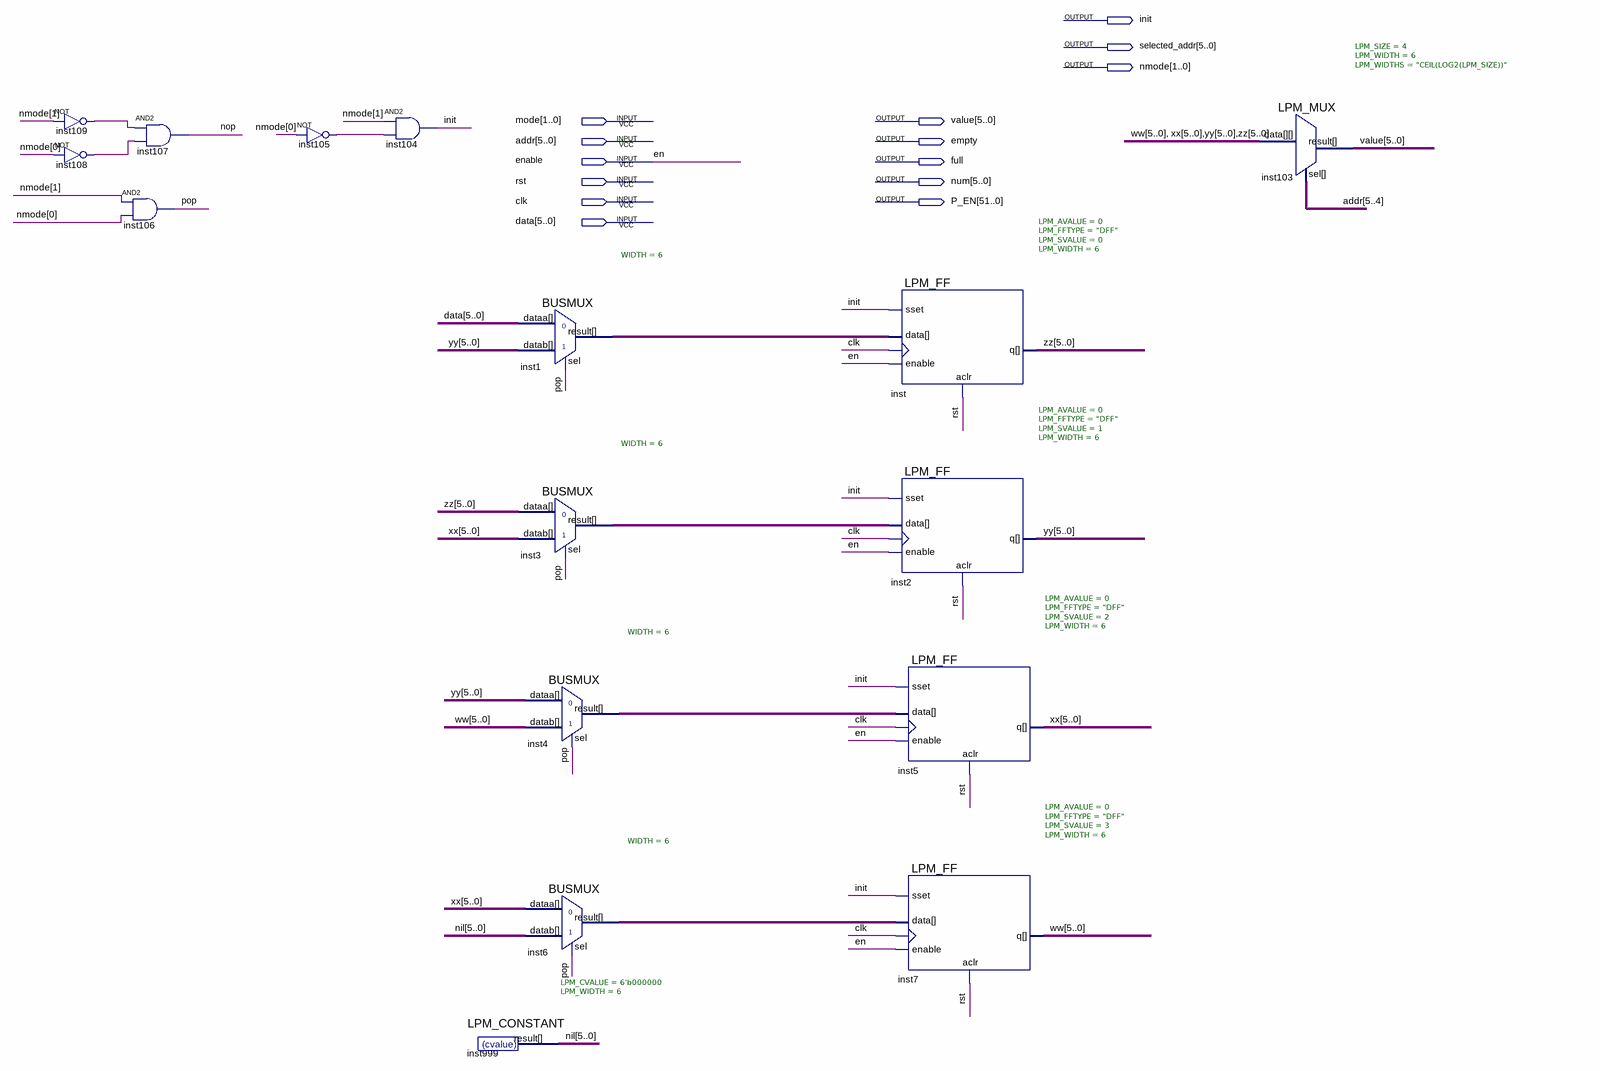
[diagram p0: schematic sheet]
// Quartus schematic g58_stack.bdf as structural Verilog: 16 symbols, 14 pins
module g58_stack (
  input  [1:0] mode,
  input  [5:0] addr,
  input  enable,
  input  rst,
  input  clk,
  input  [5:0] data,
  output init,
  output [5:0] selected_addr,
  output [1:0] nmode,
  output [5:0] value,
  output empty,
  output full,
  output [5:0] num,
  output [51:0] P_EN
);

  wire inst105_out, inst108_out, inst109_out, nop, pop;
  wire [5:0] inst1_result, inst3_result, inst4_result, inst6_result, nil, ww, xx, yy, zz;

  not inst109 (inst109_out, nmode[1]);
  not inst108 (inst108_out, nmode[0]);
  and inst107 (nop, inst109_out, inst108_out);
  and inst106 (pop, nmode[1], nmode[0]);
  not inst105 (inst105_out, nmode[0]);
  and inst104 (init, nmode[1], inst105_out);
  LPM_CONSTANT #(.LPM_CVALUE(6'b000000), .LPM_WIDTH(6)) inst999 (.result(nil));
  BUSMUX #(.WIDTH(6)) inst1 (.datab(yy), .sel(pop), .dataa(data), .result(inst1_result));
  BUSMUX #(.WIDTH(6)) inst3 (.datab(xx), .sel(pop), .dataa(zz), .result(inst3_result));
  BUSMUX #(.WIDTH(6)) inst4 (.datab(ww), .sel(pop), .dataa(yy), .result(inst4_result));
  BUSMUX #(.WIDTH(6)) inst6 (.datab(nil), .sel(pop), .dataa(xx), .result(inst6_result));
  LPM_FF #(.LPM_AVALUE(0), .LPM_FFTYPE("DFF"), .LPM_SVALUE(0), .LPM_WIDTH(6)) inst (
    .aclr(rst), .clock(clk), .data(inst1_result), .enable(enable), .sset(init), .q(zz));
  LPM_FF #(.LPM_AVALUE(0), .LPM_FFTYPE("DFF"), .LPM_SVALUE(1), .LPM_WIDTH(6)) inst2 (
    .aclr(rst), .clock(clk), .data(inst3_result), .enable(enable), .sset(init), .q(yy));
  LPM_FF #(.LPM_AVALUE(0), .LPM_FFTYPE("DFF"), .LPM_SVALUE(2), .LPM_WIDTH(6)) inst5 (
    .aclr(rst), .clock(clk), .data(inst4_result), .enable(enable), .sset(init), .q(xx));
  LPM_FF #(.LPM_AVALUE(0), .LPM_FFTYPE("DFF"), .LPM_SVALUE(3), .LPM_WIDTH(6)) inst7 (
    .aclr(rst), .clock(clk), .data(inst6_result), .enable(enable), .sset(init), .q(ww));
  LPM_MUX #(.LPM_SIZE(4), .LPM_WIDTH(6), .LPM_WIDTHS("CEIL(LOG2(LPM_SIZE))")) inst103 (
    .data({ww, xx, yy, zz}), .sel(addr[5:4]), .result(value));

  // Other names for the same wires on the sheet: en = enable
endmodule
